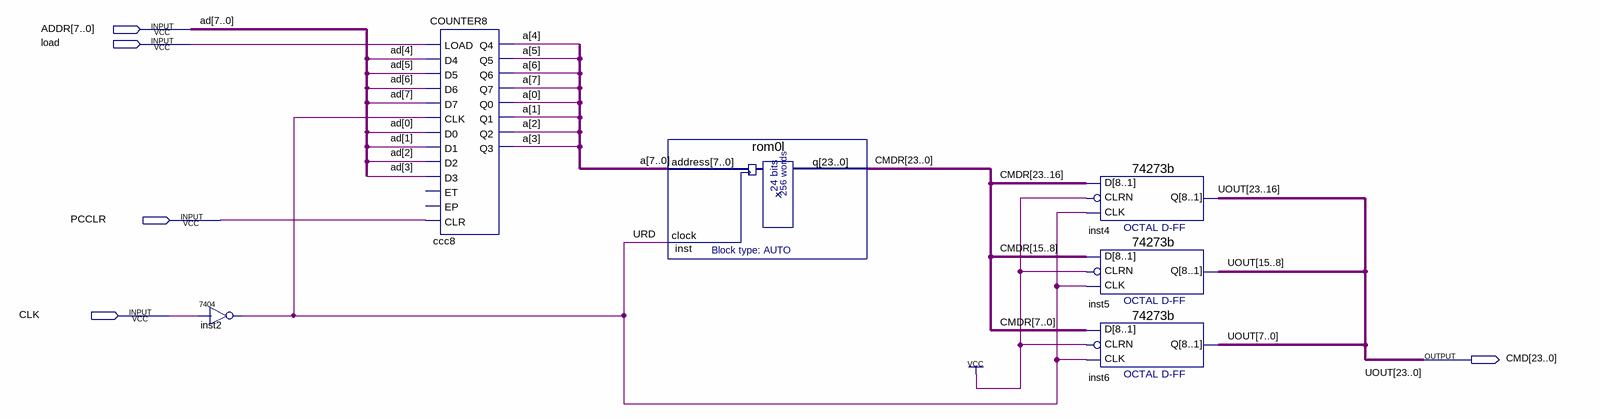
[diagram p0: schematic sheet]
// Quartus schematic 8RromR24.bdf as structural Verilog: 6 symbols, 5 pins
module \8RromR24  (
  input  [7:0] ADDR,
  input  load,
  input  PCCLR,
  input  CLK,
  output [23:0] CMD
);

  wire URD;
  wire [7:0] a;
  wire [23:0] CMDR;

  \7404  inst2 (.\2 (CLK), .\1 (URD));
  COUNTER8 ccc8 (
    .LOAD(load), .D4(ADDR[4]), .D5(ADDR[5]), .D6(ADDR[6]), .D7(ADDR[7]), .CLK(URD), .D0(ADDR[0]),
    .D1(ADDR[1]), .D2(ADDR[2]), .D3(ADDR[3]), .CLR(PCCLR), .Q4(a[4]), .Q5(a[5]), .Q6(a[6]), .Q7(a[7]),
    .Q0(a[0]), .Q1(a[1]), .Q2(a[2]), .Q3(a[3]));  // open: ET, EP
  rom0l inst (.address(a), .clock(URD), .q(CMDR));
  \74273b  inst4 (.CLK(URD), .D(CMDR[23:16]), .CLRN(1'b1), .Q(CMD[23:16]));
  \74273b  inst5 (.CLK(URD), .D(CMDR[15:8]), .CLRN(1'b1), .Q(CMD[15:8]));
  \74273b  inst6 (.CLK(URD), .D(CMDR[7:0]), .CLRN(1'b1), .Q(CMD[7:0]));

  // Other names for the same wires on the sheet: ad[7:0] = ADDR; UOUT[23:0] = CMD
endmodule
